# EAGLE design servo_board (EAGLE 7.5.0)
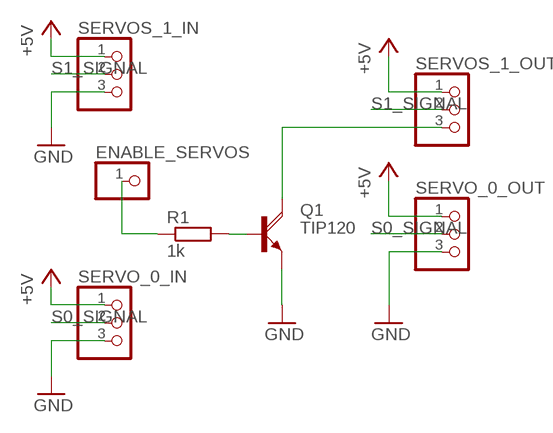
[diagram p0: schematic, sheet 1]

## Parts
ENABLE_SERVOS  PINHD-1X1  [1X01]
Q1  TIP120  [TO220AH]
R1  1k  R-EU_0204/5  [0204/5]
SERVO_0_IN  PINHD-1X3  [1X03]
SERVO_0_OUT  PINHD-1X3  [1X03]
SERVOS_1_IN  PINHD-1X3  [1X03]
SERVOS_1_OUT  PINHD-1X3  [1X03]

## Nets
+5V: SERVO_0_IN.1 SERVO_0_OUT.1 SERVOS_1_IN.1 SERVOS_1_OUT.1
GND: Q1.E SERVO_0_IN.3 SERVO_0_OUT.3 SERVOS_1_IN.3
N$1: Q1.B R1.2
N$2: ENABLE_SERVOS.1 R1.1
N$3: Q1.C SERVOS_1_OUT.3
S0_SIGNAL: SERVO_0_IN.2 SERVO_0_OUT.2
S1_SIGNAL: SERVOS_1_IN.2 SERVOS_1_OUT.2

## Library data of the parts
ENABLE_SERVOS = pinhead:PINHD-1X1: PIN HEADER
Q1 = transistor-power:TIP120: NPN DARLINGTON TRANSISTOR
R1 = rcl:R-EU_: RESISTOR, European symbol
SERVO_0_IN SERVO_0_OUT SERVOS_1_IN SERVOS_1_OUT = pinhead:PINHD-1X3: PIN HEADER

## Board
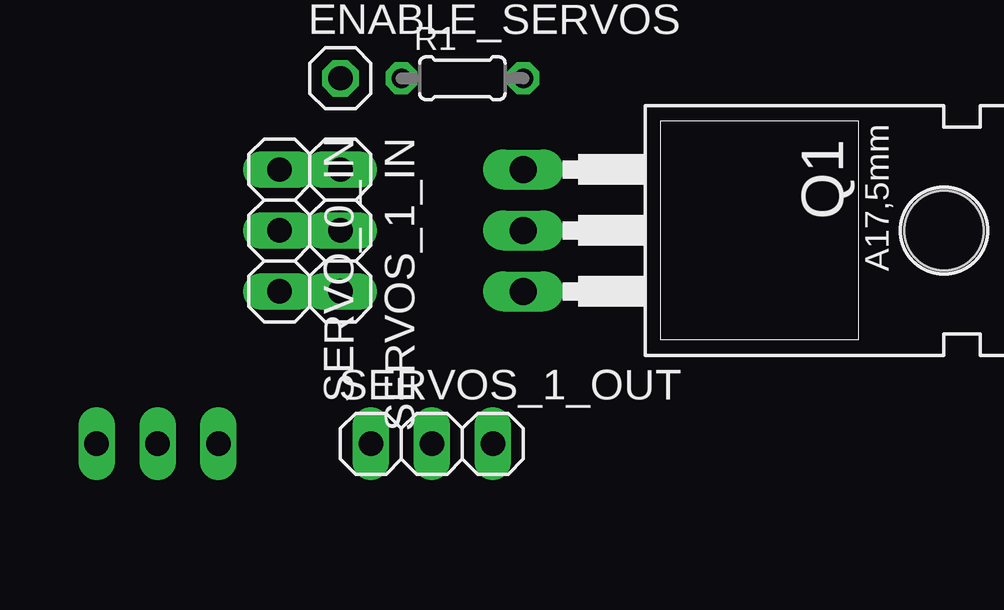
[diagram p1: board, top side]
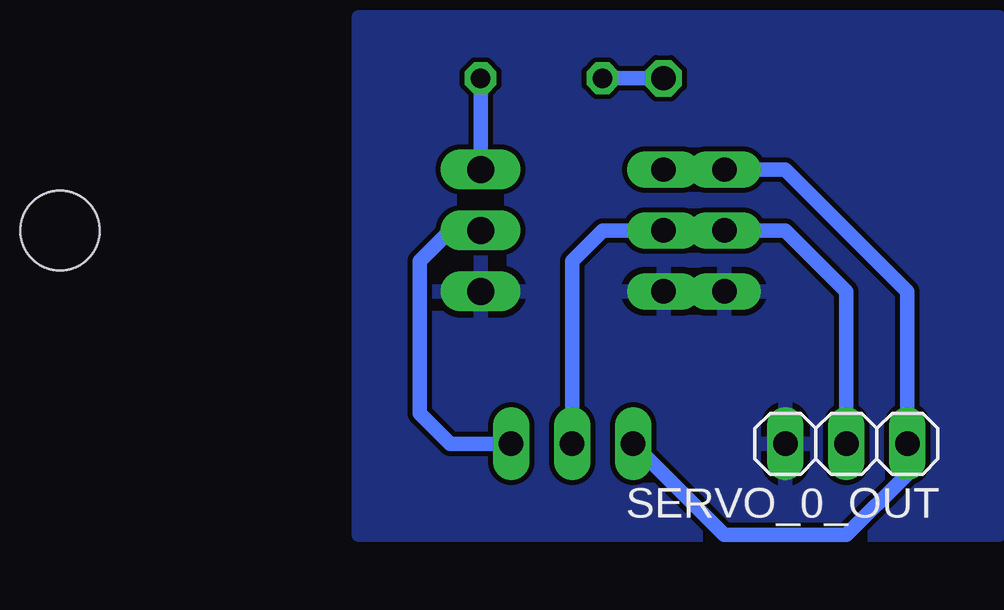
[diagram p2: board, bottom side, seen from below]

No outline drawn. Coordinates in mm, seen from the top.
Copper layers (1*16): Top 0.035mm / dielectric 1.5mm / Bottom 0.035mm
Design rules "default": minimum track width 10mil, minimum drill 24mil, track to track 8mil, track to pad 8mil, pad to pad 8mil, via to via 8mil, smd to smd 8mil, copper to edge 40mil, drill to drill 8mil, minimum pad ring 10mil, minimum via ring 8mil, stop-mask expansion 4mil, vias tented up to drill 0mil, thermal gap 10mil

### Footprints (pad centres in the part's own frame; a part is rotated, then mirrored left to right if it is on the bottom)
1X01 = drill 1.016 octagon: 1 0,0
TO220AH = drill 1.118 long: B -2.54,-6.35; C 0,-6.35; E 2.54,-6.35 | hole 3.302: 0,11.176
0204/5 = drill 0.813 octagon: 1 -2.54,0; 2 2.54,0
1X03 = drill 1.016 long: 1 -2.54,0; 2 0,0; 3 2.54,0

### Placement (x,y rotation side)
ENABLE_SERVOS  12.7,20.32 0 top
Q1  26.67,13.97 270 top
R1  17.78,20.32 0 top
SERVO_0_IN  10.16,13.97 270 top
SERVO_0_OUT  5.08,5.08 180 bottom
SERVOS_1_IN  12.7,13.97 270 top
SERVOS_1_OUT  16.51,5.08 0 top

### Tracks (layer width: path | path; a pad name or v marks a point on that pad's centre or on a via)
+5V
  Bottom 0.61: SERVOS_1_IN.1 SERVO_0_IN.1 7.62,16.51 2.54,11.43 SERVO_0_OUT.1 2.54,3.81 5.08,1.27 10.16,1.27 SERVOS_1_OUT.1
GND
  pour Bottom: -1.27,20.32 -1.27,1.27 25.4,1.27 25.4,22.86 -1.27,22.86
N$1
  Bottom 0.61: Q1.B R1.2
N$2
  Bottom 0.61: R1.1 ENABLE_SERVOS.1
N$3
  Bottom 0.61: Q1.C 21.59,13.97 22.86,12.7 22.86,6.35 21.59,5.08 SERVOS_1_OUT.3
S0_SIGNAL
  Bottom 0.61: SERVO_0_OUT.2 5.08,11.43 7.62,13.97 SERVO_0_IN.2
S1_SIGNAL
  Bottom 0.61: SERVOS_1_OUT.2 16.51,12.7 15.24,13.97 SERVOS_1_IN.2